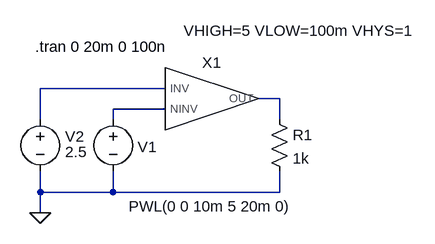
[diagram p0: schematic test compTOF.asc]
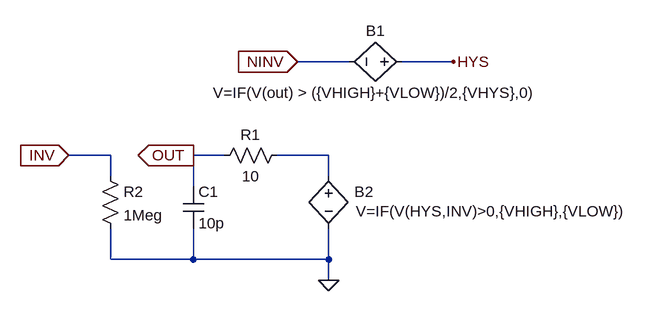
[diagram p1: sub-circuit comptof.asc]
test compTOF.asc, the LTspice schematic file:
Version 4
SHEET 1 880 680
WIRE 80 176 -112 176
WIRE 256 192 224 192
WIRE 80 208 0 208
WIRE -112 224 -112 176
WIRE 0 224 0 208
WIRE 256 224 256 192
WIRE -112 336 -112 304
WIRE 0 336 0 304
WIRE 0 336 -112 336
WIRE 256 336 256 304
WIRE 256 336 0 336
WIRE -112 368 -112 336
FLAG -112 368 0
SYMBOL COMPTOF 144 192 R0
WINDOW 39 142 -89 Bottom 2
SYMATTR InstName X1
SYMATTR SpiceLine VHIGH=5 VLOW=100m VHYS=1
SYMBOL voltage 0 208 R0
WINDOW 0 38 58 Left 2
WINDOW 3 24 150 Left 2
WINDOW 123 0 0 Left 0
WINDOW 39 0 0 Left 0
SYMATTR InstName V1
SYMATTR Value PWL(0 0 10m 5 20m 0)
SYMBOL voltage -112 208 R0
WINDOW 0 38 42 Left 2
WINDOW 3 38 66 Left 2
WINDOW 123 0 0 Left 0
WINDOW 39 0 0 Left 0
SYMATTR InstName V2
SYMATTR Value 2.5
SYMBOL res 240 208 R0
SYMATTR InstName R1
SYMATTR Value 1k
TEXT -120 112 Left 2 !.tran 0 20m 0 100n

comptof.asc, the sub-circuit schematic file:
Version 4
SHEET 1 880 680
WIRE 64 192 -16 192
WIRE 224 192 144 192
WIRE -304 336 -368 336
WIRE -128 336 -176 336
WIRE 32 336 -48 336
WIRE -304 368 -304 336
WIRE 32 368 32 336
WIRE -176 384 -176 336
WIRE -304 496 -304 448
WIRE -176 496 -176 448
WIRE -176 496 -304 496
WIRE 32 496 32 448
WIRE 32 496 -176 496
WIRE 32 528 32 496
FLAG -16 192 NINV
IOPIN -16 192 In
FLAG 224 192 HYS
FLAG 32 528 0
FLAG -176 336 OUT
IOPIN -176 336 Out
FLAG -368 336 INV
IOPIN -368 336 In
SYMBOL bv 160 192 R90
WINDOW 0 -32 56 VBottom 2
WINDOW 3 32 56 VTop 2
SYMATTR InstName B1
SYMATTR Value V=IF(V(out) > ({VHIGH}+{VLOW})/2,{VHYS},0)
SYMBOL bv 32 352 R0
WINDOW 0 40 40 Left 2
WINDOW 3 42 70 Left 2
SYMATTR InstName B2
SYMATTR Value V=IF(V(HYS,INV)>0,{VHIGH},{VLOW})
SYMBOL res -32 320 R90
WINDOW 0 0 56 VBottom 2
WINDOW 3 32 56 VTop 2
SYMATTR InstName R1
SYMATTR Value 10
SYMBOL cap -192 384 R0
SYMATTR InstName C1
SYMATTR Value 10p
SYMBOL res -320 352 R0
SYMATTR InstName R2
SYMATTR Value 1Meg

The netlist it stands for:
* test compTOF.asc
XX1 N001 N003 N002 comptof params: VHIGH=5 VLOW=100m VHYS=1
V1 N003 0 PWL(0 0 10m 5 20m 0)
V2 N001 0 2.5
R1 N002 0 1k

* block symbol definitions
.subckt comptof INV NINV OUT
B1 HYS NINV V=IF(V(out) > ({VHIGH}+{VLOW})/2,{VHYS},0)
B2 N001 0 V=IF(V(HYS,INV)>0,{VHIGH},{VLOW})
R1 N001 OUT 10
C1 OUT 0 10p
R2 INV 0 1Meg
.ends comptof

.tran 0 20m 0 100n
.backanno
.end